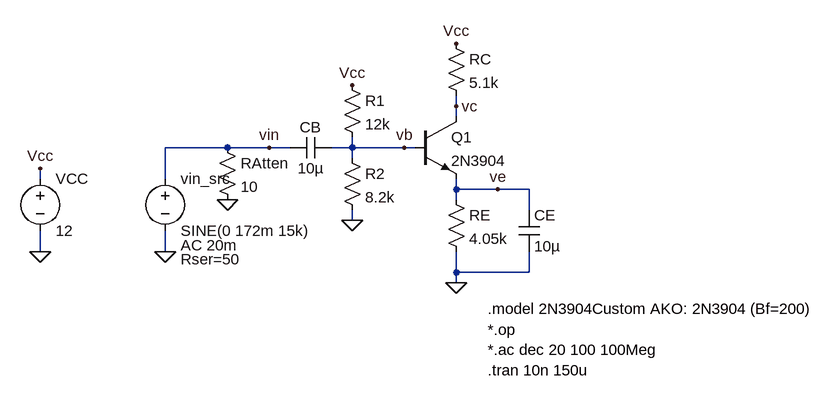
[diagram p0: schematic lab4.asc]
lab4.asc, the LTspice schematic file:
Version 4
SHEET 1 1092 680
WIRE 528 160 528 144
WIRE 528 176 528 160
WIRE 176 224 80 224
WIRE 240 224 176 224
WIRE 272 224 240 224
WIRE 368 224 368 208
WIRE 368 224 336 224
WIRE 448 224 368 224
WIRE 464 224 448 224
WIRE 368 240 368 224
WIRE -112 272 -112 256
WIRE 80 272 80 224
WIRE 528 288 528 272
WIRE 592 288 528 288
WIRE 640 288 592 288
WIRE 528 304 528 288
WIRE 640 320 640 288
WIRE 368 336 368 320
WIRE -112 384 -112 352
WIRE 80 384 80 352
WIRE 528 416 528 384
WIRE 640 416 640 384
WIRE 640 416 528 416
WIRE 528 432 528 416
FLAG 80 384 0
FLAG 528 432 0
FLAG 368 336 0
FLAG -112 384 0
FLAG 240 224 vin
FLAG 592 288 ve
FLAG 448 224 vb
FLAG 528 160 vc
FLAG 176 304 0
FLAG -112 256 Vcc
FLAG 368 128 Vcc
FLAG 528 64 Vcc
SYMBOL Res 352 112 R0
SYMATTR InstName R1
SYMATTR Value 12k
SYMBOL Res 352 224 R0
SYMATTR InstName R2
SYMATTR Value 8.2k
SYMBOL Cap 336 208 R90
WINDOW 0 0 32 VBottom 2
WINDOW 3 32 32 VTop 2
SYMATTR InstName CB
SYMATTR Value 10µ
SYMBOL Res 512 48 R0
SYMATTR InstName RC
SYMATTR Value 5.1k
SYMBOL Res 512 288 R0
SYMATTR InstName RE
SYMATTR Value 4.05k
SYMBOL Cap 624 320 R0
SYMATTR InstName CE
SYMATTR Value 10µ
SYMBOL Voltage 80 256 R0
WINDOW 123 24 118 Left 2
WINDOW 39 24 140 Left 2
SYMATTR Value2 AC 20m
SYMATTR SpiceLine Rser=50
SYMATTR InstName vin_src
SYMATTR Value SINE(0 172m 15k)
SYMBOL npn 464 176 R0
SYMATTR InstName Q1
SYMATTR Value 2N3904
SYMBOL Voltage -112 256 R0
SYMATTR InstName VCC
SYMATTR Value 12
SYMBOL Res 160 208 R0
SYMATTR InstName RAtten
SYMATTR Value 10
TEXT 576 472 Left 2 !.model 2N3904Custom AKO: 2N3904 (Bf=200)
TEXT 576 504 Left 2 !*.op\n*.ac dec 20 100 100Meg\n.tran 10n 150u

The netlist it stands for:
* lab4.asc
R1 Vcc vb 12k
R2 vb 0 8.2k
CB vb vin 10µ
RC Vcc vc 5.1k
RE ve 0 4.05k
CE ve 0 10µ
vin_src vin 0 SINE(0 172m 15k) AC 20m Rser=50
Q1 vc vb ve 0 2N3904
VCC Vcc 0 12
RAtten vin 0 10
.model NPN NPN
.model PNP PNP
.lib standard.bjt
.model 2N3904Custom AKO: 2N3904 (Bf=200)
*.op
*.ac dec 20 100 100Meg
.tran 10n 150u
.backanno
.end